# Altium schematic sheet Sheet1.SCHDOC: Remote Controller Radio 8Dev
size 420 x 297 mm; SheetNumber: 1; SheetTotal: 1; Scale: {Масш.}; Title1str: {Наименование}; PageSetup: Record=PageOptions|CenterHorizontal=False|CenterVertical=False|PrintScale=0.95|XCorrection=0.00|YCorrection=0.00|PrintKind=1|BorderSize=5000000|LeftOffset=0|BottomOffset=0|Orientation=1|PaperLength=1000|PaperWidth=1000|Scale=100|PaperSource=15|PrintQuality=600|MediaType=1|DitherType=10|PaperKind=A4|PrintScaleMode=1; Title2str: {Наименование}; ProcessInspection: {Т.контр.}; Mass: {Масса}; NormInspection: {Н.контр.}; EngineerName: {Инженер}; Letter1Column: {}; Letter2Column: {}; Letter3Column: {}; DocumentType: {Документ}; DocumentType1str: {Документ}; DocumentType2str: {Документ}; DocumentName: Sheet1.SCHDOC
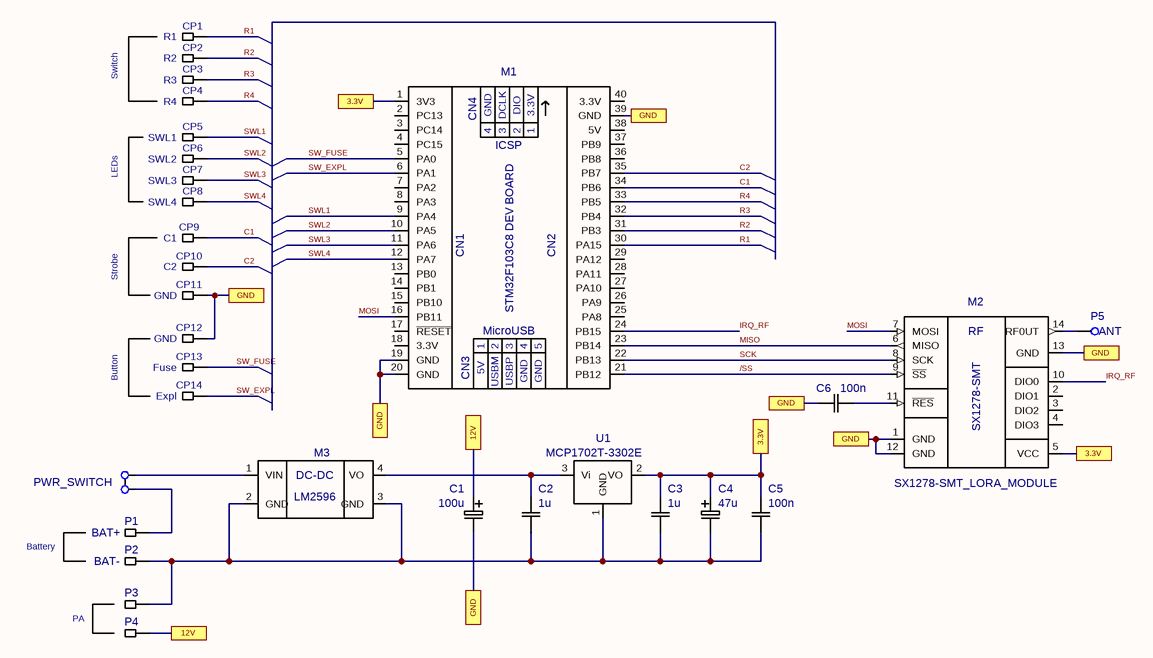
[diagram p0: Sheet1.SCHDOC]

## Parts
C1  value 100u  [TAJHT1210]  (hidden comment: TAJHT1210)
C2  value 1u  [C0805]  (hidden comment: CAP_SMD_0805)
C3  value 1u  [C0805]  (hidden comment: CAP_SMD_0805)
C4  value 47u  [TAJHT1210]  (hidden comment: TAJHT1210)
C5  value 100n  [C0805]  (hidden comment: CAP_SMD_0805)
C6  value 100n  [C0805]  (hidden comment: CAP_SMD_0805)
CP1  value R1  [PAD_RRX60Y60D0T]  (hidden comment: PAD_RRX60Y60D0T)
CP2  value R2  [PAD_RRX60Y60D0T]  (hidden comment: PAD_RRX60Y60D0T)
CP3  value R3  [PAD_RRX60Y60D0T]  (hidden comment: PAD_RRX60Y60D0T)
CP4  value R4  [PAD_RRX60Y60D0T]  (hidden comment: PAD_RRX60Y60D0T)
CP5  value SWL1  [PAD_RRX60Y60D0T]  (hidden comment: PAD_RRX60Y60D0T)
CP6  value SWL2  [PAD_RRX60Y60D0T]  (hidden comment: PAD_RRX60Y60D0T)
CP7  value SWL3  [PAD_RRX60Y60D0T]  (hidden comment: PAD_RRX60Y60D0T)
CP8  value SWL4  [PAD_RRX60Y60D0T]  (hidden comment: PAD_RRX60Y60D0T)
CP9  value C1  [PAD_RRX60Y60D0T]  (hidden comment: PAD_RRX60Y60D0T)
CP10  value C2  [PAD_RRX60Y60D0T]  (hidden comment: PAD_RRX60Y60D0T)
CP11  value GND  [PAD_RRX60Y60D0T]  (hidden comment: PAD_RRX60Y60D0T)
CP12  value GND  [PAD_RRX60Y60D0T]  (hidden comment: PAD_RRX60Y60D0T)
CP13  value Fuse  [PAD_RRX60Y60D0T]  (hidden comment: PAD_RRX60Y60D0T)
CP14  value Expl  [PAD_RRX60Y60D0T]  (hidden comment: PAD_RRX60Y60D0T)
M1  STM32F103_DEV_BOARD  [STM32F103C8_DEV_BOARD]  (value not drawn)
M2  SX1278-SMT_LORA_MODULE  [SX1278-SMT_MODULE]
M3  LM2596_DC-DC  [LM2596_DC-DC]  (value not drawn)
P1  value BAT+  [PAD_RRX60Y120D0T]  (hidden comment: PAD_RRX60Y120D0T)
P2  value BAT-  [PAD_RRX60Y120D0T]  (hidden comment: PAD_RRX60Y120D0T)
P3  PAD_RRX60Y120D0T  [PAD_RRX60Y120D0T]  (value not drawn)
P4  PAD_RRX60Y120D0T  [PAD_RRX60Y120D0T]  (value not drawn)
P5  value ANT  [PAD_EX32Y32AD20]  (hidden comment: PAD_EX32Y32D20)
PWR_SWITCH  2P:EX60Y60D0T-CD100  [2P:EX60Y60D0T-CD100]  (value not drawn)
U1  MCP1702T-3302E  [SOT23A]

## Ports
3.3V, 12V, GND

## Nets
3.3V: C3.2(B) C4.1 C5.2(B) M1.1(3V3) M2.5(VCC) U1.2(VO) ; port 3.3V
12V: C1.1 P4.1 ; port 12V
/SS: M1.21(PB12) M2.9(~{SS})
C1: CP9.1 M1.34(PB6)
C2: CP10.1 M1.35(PB7)
GND: C1.2 C6.1(A) CP11.1 CP12.1 M1.19(GND) M1.20(GND) M1.39(GND) M2.1(GND) M2.12(GND) M2.13(GND) ; port GND
IRQ_RF: M1.24(PB15) M2.10(DIO0)
MISO: M1.23(PB14) M2.6(MISO)
MOSI: M1.16(PB11) M2.7(MOSI)
R1: CP1.1 M1.30(PA15)
R2: CP2.1 M1.31(PB3)
R3: CP3.1 M1.32(PB4)
R4: CP4.1 M1.33(PB5)
SCK: M1.22(PB13) M2.8(SCK)
SW_EXPL: CP14.1 M1.6(PA1)
SW_FUSE: CP13.1 M1.5(PA0)
SWL1: CP5.1 M1.9(PA4)
SWL2: CP6.1 M1.10(PA5)
SWL3: CP7.1 M1.11(PA6)
SWL4: CP8.1 M1.12(PA7)
NetC2_1: C2.1(A) C3.1(A) C4.2 C5.1(A) M3.2(GND) M3.3(GND) P2.1 P3.1 U1.1(GND)
NetC2_2: C2.2(B) M3.4(VO) U1.3(Vi)
NetC6_2: C6.2(B) M2.11(~{RES})
NetM2_14: M2.14(RF0UT) P5.1
NetM3_1: M3.1(VIN) PWR_SWITCH.1
NetP1_1: P1.1 PWR_SWITCH.2

Not connected (* = marked no-connect by the designer): M1 2(PC13) 3(PC14) 4(PC15) 7(PA2) 8(PA3) 13(PB0) 14(PB1) 15(PB10) 17(~{RESET}) 18(3.3V) 25(PA8) 26(PA9) 27(PA10) 28(PA11) 29(PA12) 36(PB8) 37(PB9) 38(5V) 40(3.3V); M2 2(DIO1) 3(DIO2) 4(DIO3)

## Notes on the sheet
- Switch
- LEDs
- Strobe
- Button
- Battery
- PA
- Перв. примен.
- Справ. №
- Подп. и дата
- Инв. № дубл.
- Взам. инв. №
- Изм.
- Лист
- № докум.
- Подп.
- Дата
- Лит.
- Масса
- Масштаб
- Т.контр.
- Пров.
- Разраб.
- Листов
- Инв. № подл.
- Н.контр.
- Утв.
- Копировал
- Формат А3
- (in symbol LM2596_DC-DC) DC-DC; LM2596
- (in symbol STM32F103_DEV_BOARD) CN4; DCLK; DIO; ICSP; STM32F103C8 DEV BOARD; CN1; CN2; MicroUSB; CN3; USBM; USBP
- (in symbol SX1278-SMT_LORA_MODULE) RF; SX1278-SMT

## Library data of the parts
M2 = SX1278-SMT_LORA_MODULE: Radiomodule LoRa. 433MHz 20mW max.; Value: *
M3 = LM2596_DC-DC: Converter DC-DC Module; Value: *
U1 = MCP1702T-3302E: Voltage Stabilizer 3.3V 100mA Iq=2uA; Value: *
M1 = STM32F103_DEV_BOARD: Value: *
PWR_SWITCH = 2P:EX60Y60D0T-CD100: Value: *